# Altium schematic sheet BottomBoard.schdoc
size A1
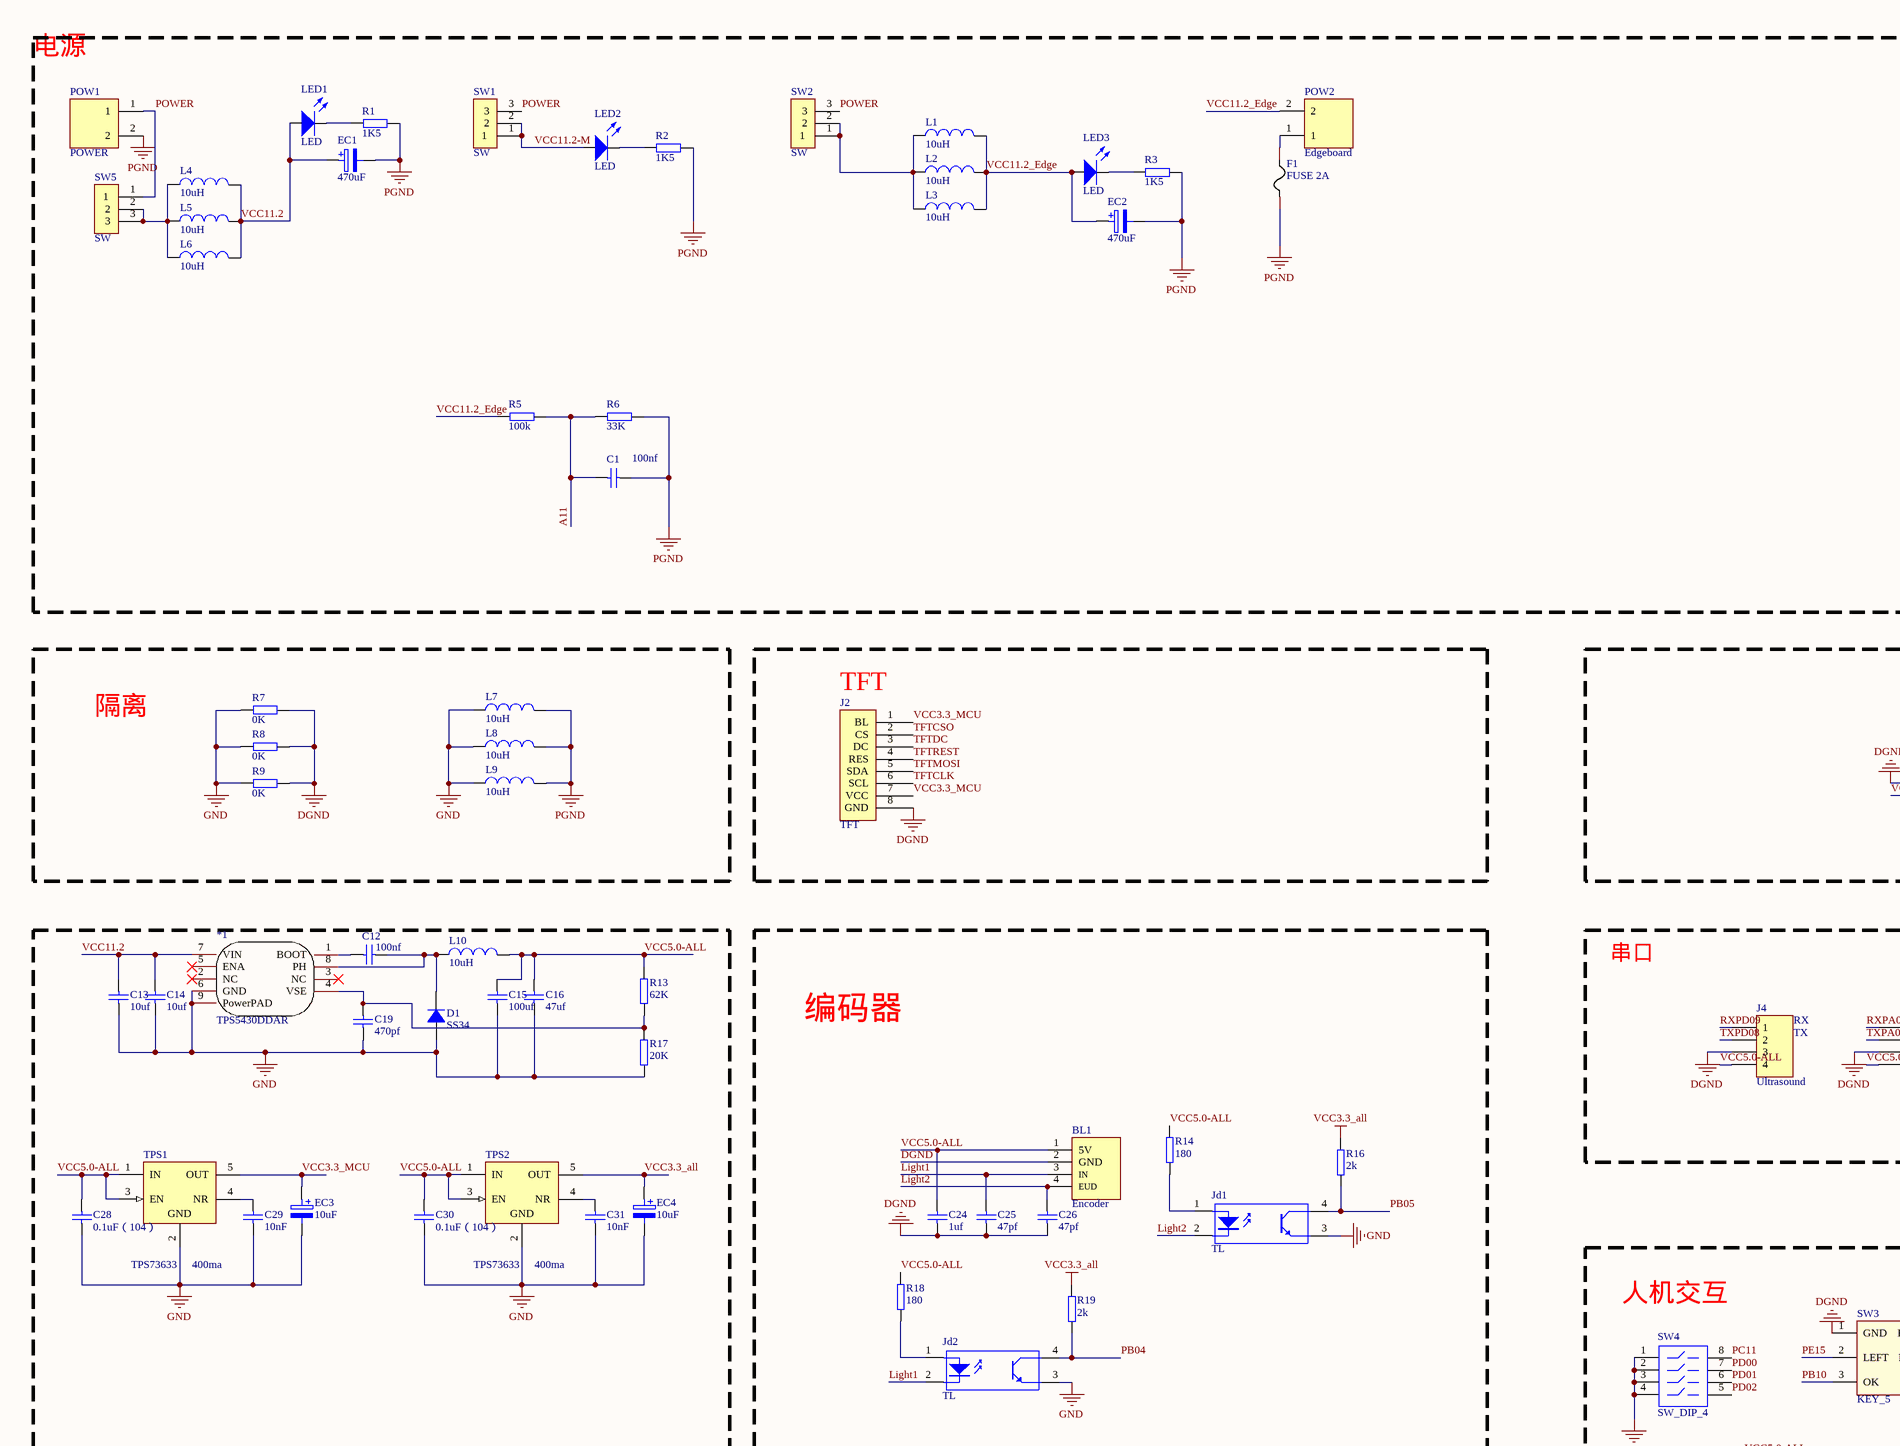
[diagram p0: BottomBoard.schdoc, top left]
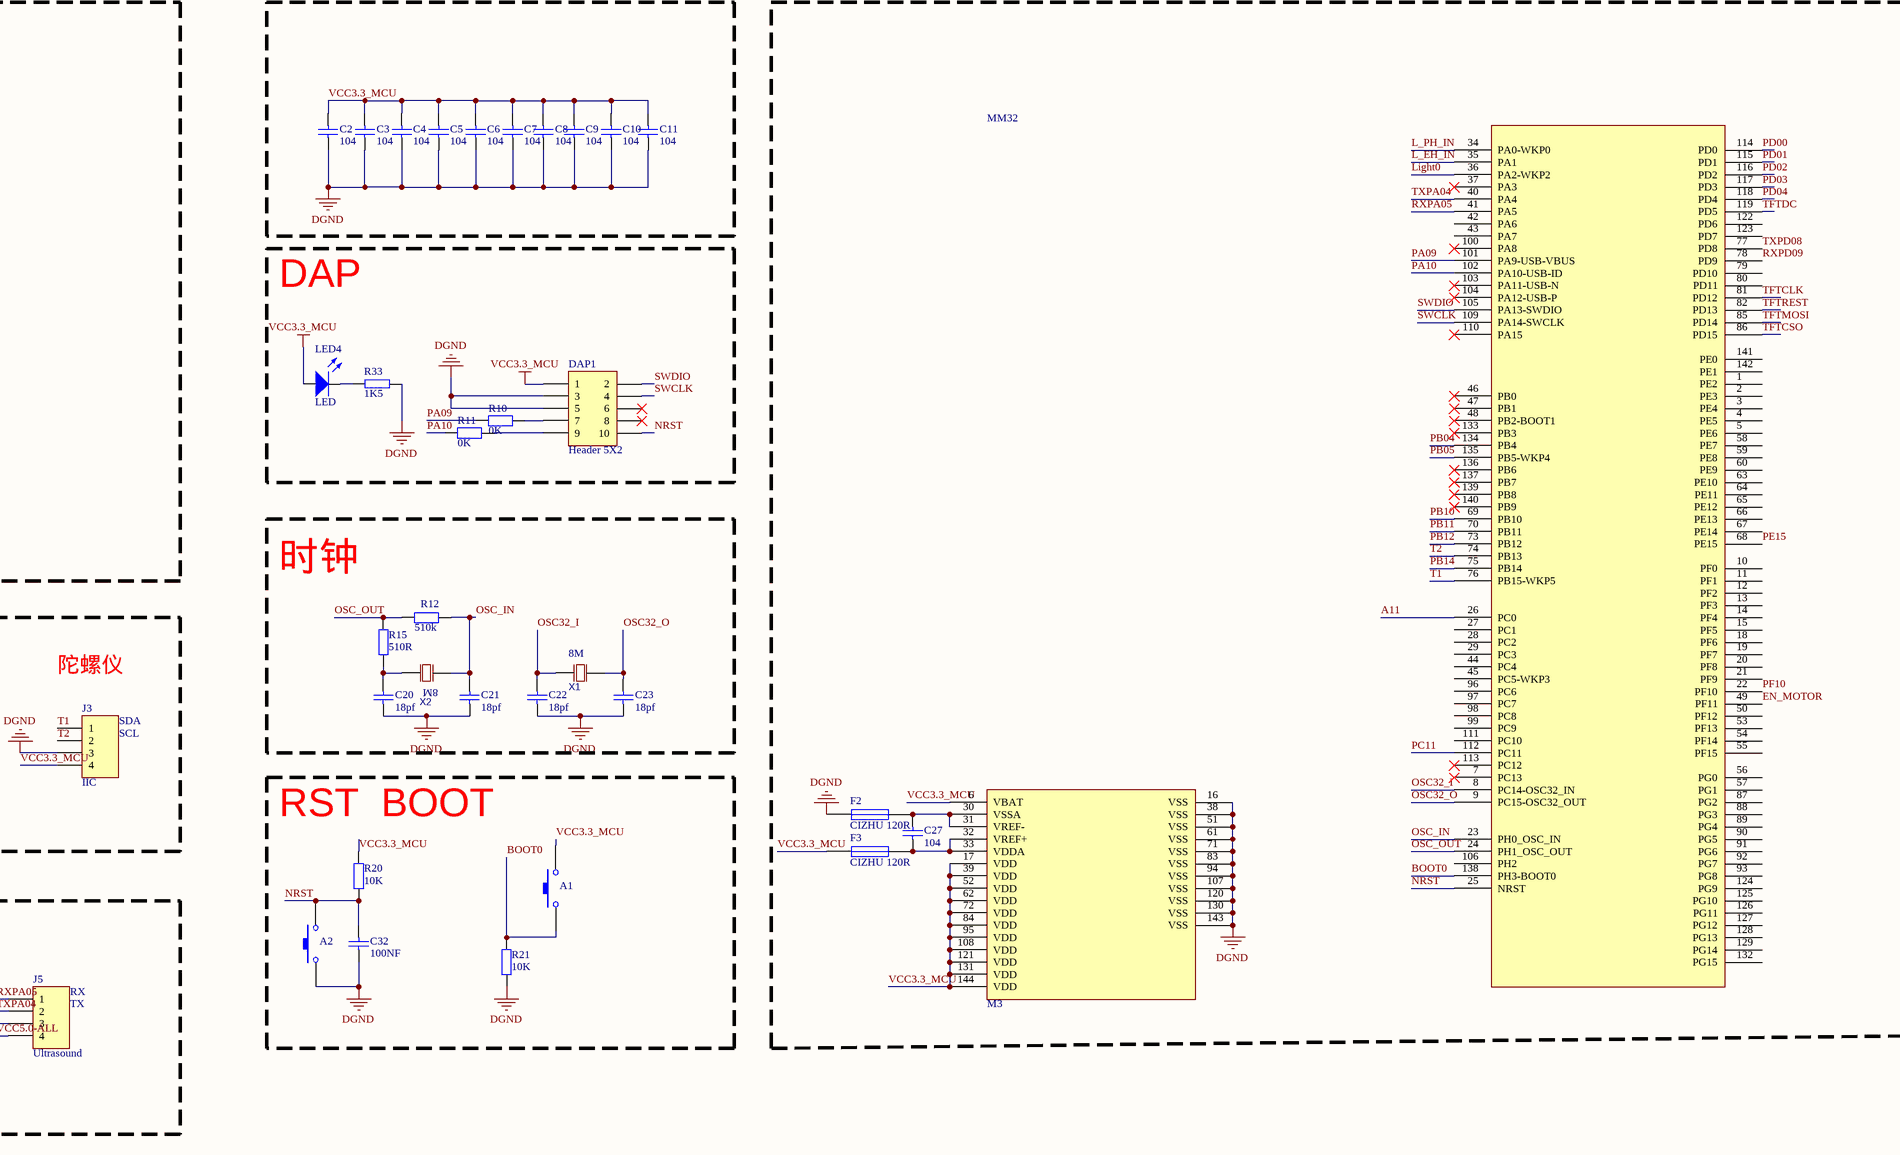
[diagram p1: BottomBoard.schdoc, top right]
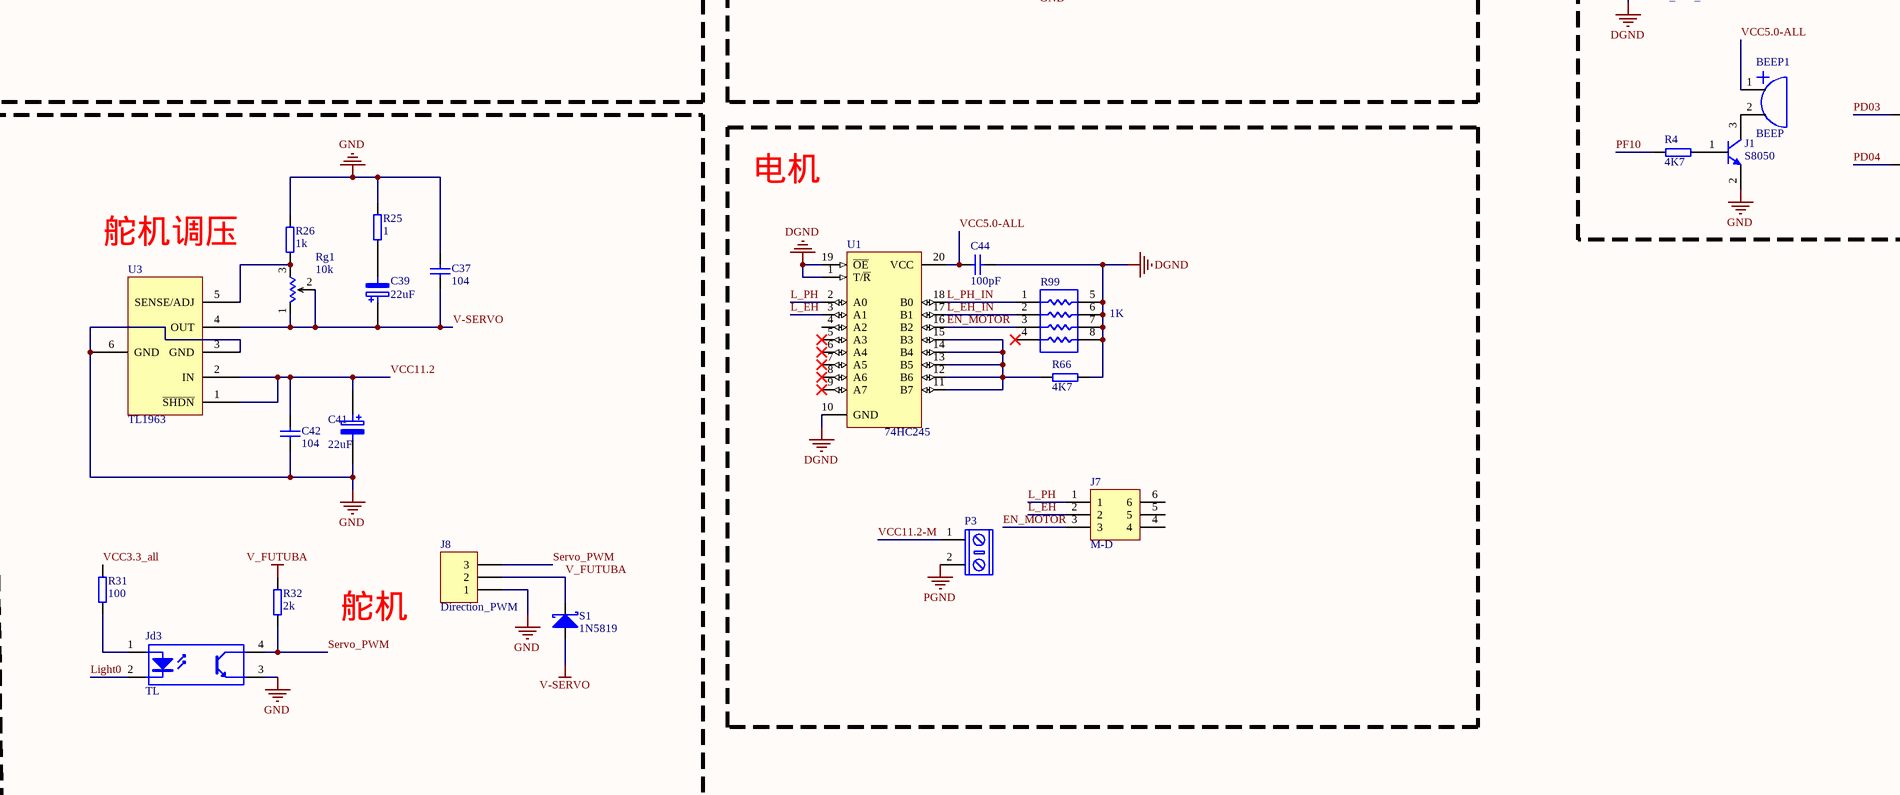
[diagram p2: BottomBoard.schdoc, bottom left]
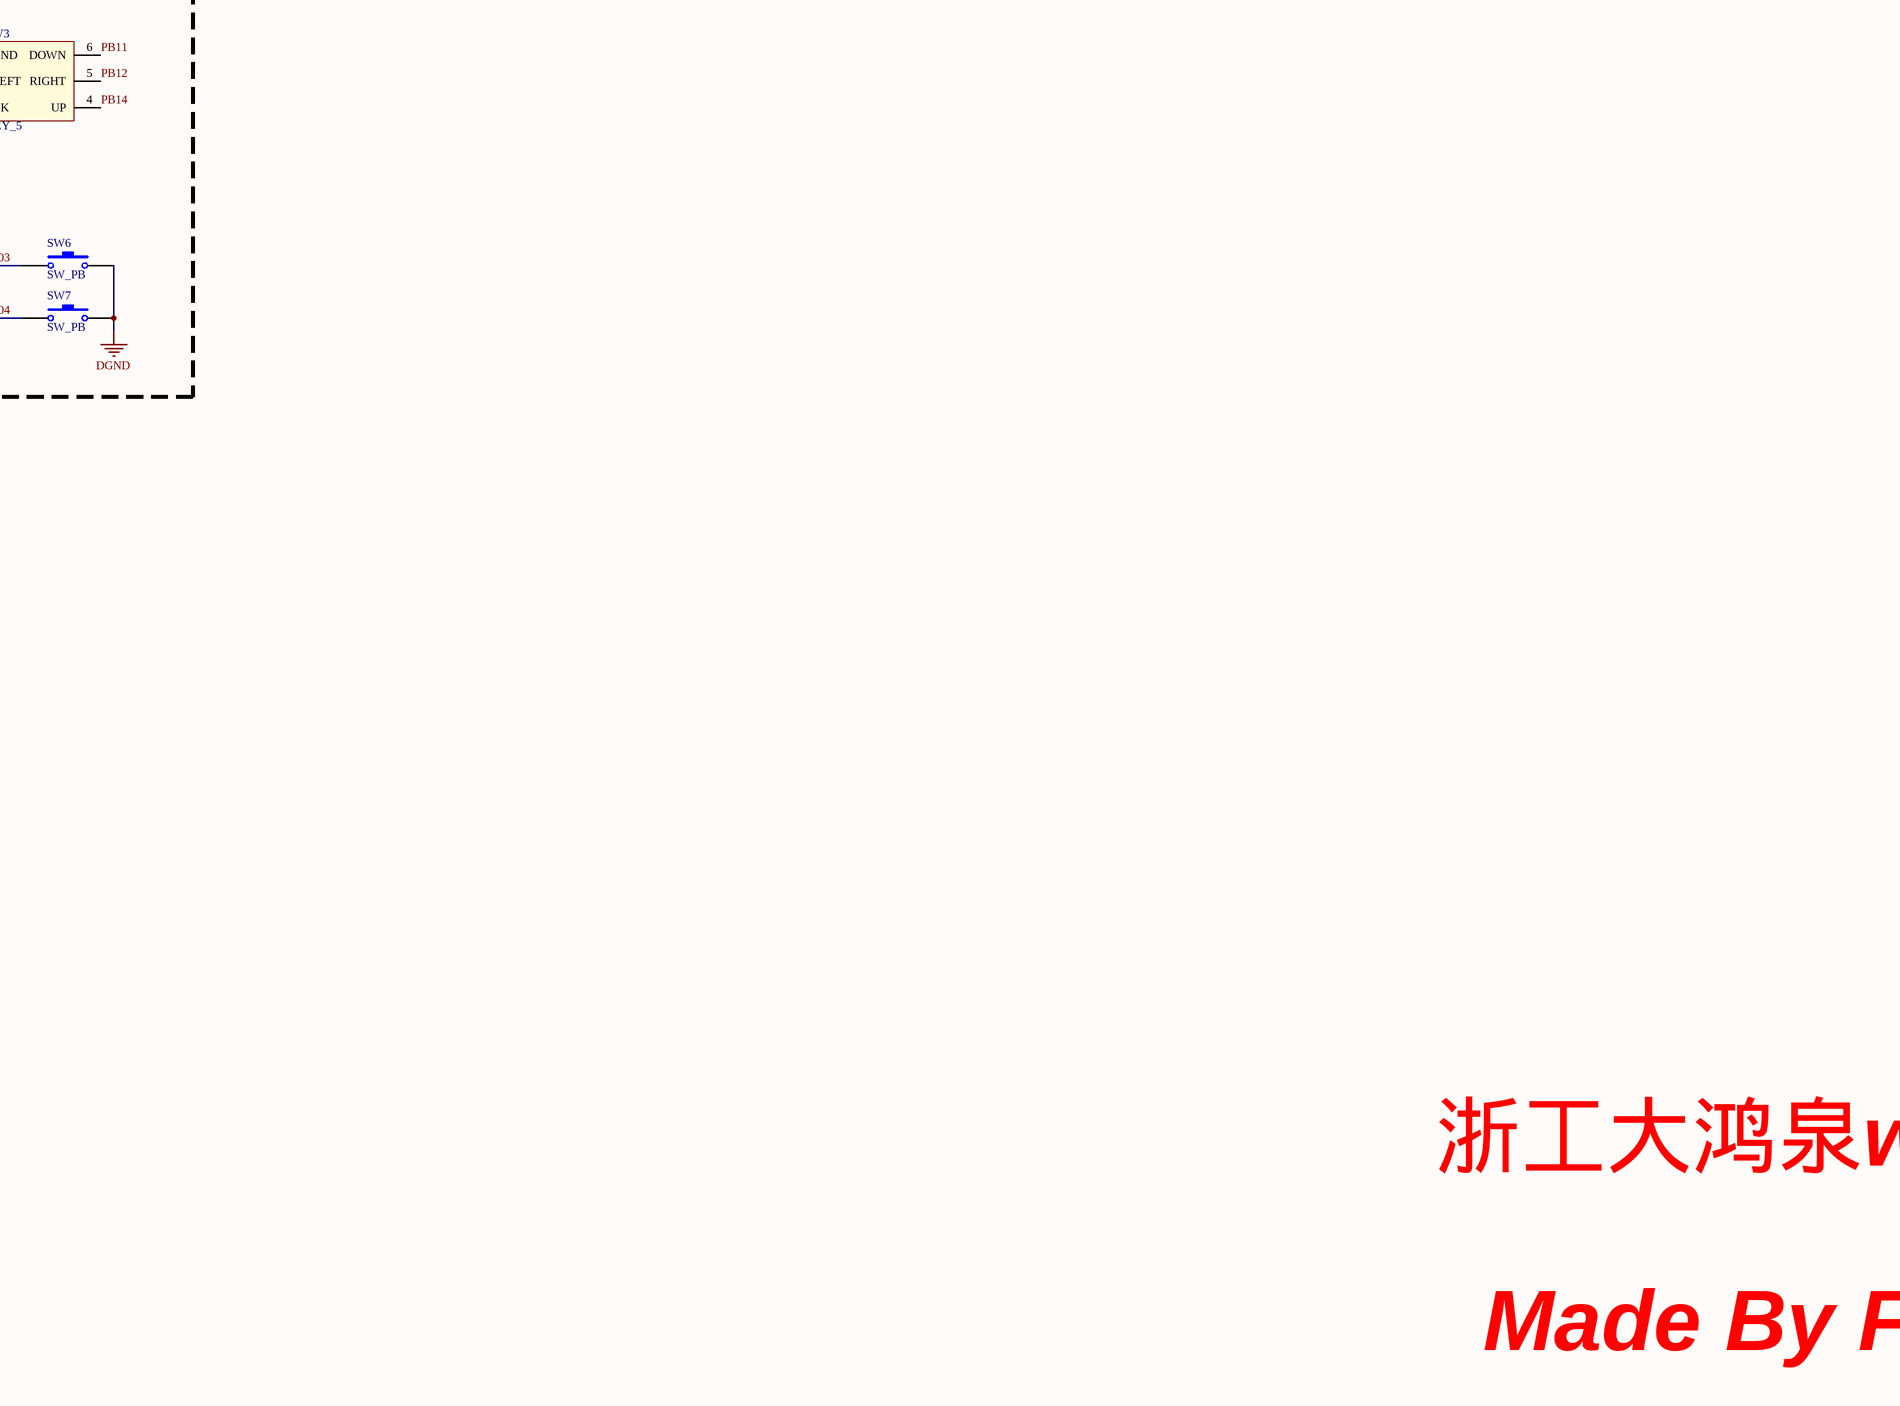
[diagram p3: BottomBoard.schdoc, bottom right]

## Parts
*1  TPS5430DDAR  [SOIC-8_L5.0-W4.0-P1.27-LS6.0-BL-EP2.0]
A1  SW-PB  [KEY-SMD_B3U-1000PM]  (value not drawn)
A2  SW-PB  [KEY-SMD_B3U-1000PM]  (value not drawn)
BEEP1  BEEP  [BEEP]
BL1  Encoder  [HDR1X4_2.54_4pin]
C1  100nf  [0603_C]
C2  104  [0603_C]
C3  104  [0603_C]
C4  104  [0603_C]
C5  104  [0603_C]
C6  104  [0603_C]
C7  104  [0603_C]
C8  104  [0603_C]
C9  104  [0603_C]
C10  104  [0603_C]
C11  104  [0603_C]
C12  100nf  [0603_C]
C13  10uf  [0603_C]
C14  10uf  [0603_C]
C15  100uf  [0603_C]
C16  47uf  [0603_C]
C19  470pf  [0603_C]
C20  18pf  [LC-0603_C]
C21  18pf  [LC-0603_C]
C22  18pf  [LC-0603_C]
C23  18pf  [LC-0603_C]
C24  1uf  [0603_C]
C25  47pf  [0603_C]
C26  47pf  [0603_C]
C27  104  [0603_C]
C28  0.1uF（104）  [0603_C]
C29  10nF  [0603_C]
C30  0.1uF（104）  [0603_C]
C31  10nF  [0603_C]
C32  100NF  [LC-0603_C]
C37  104  [0603_C]
C39  22uF  [CASE-B_3528]
C41  22uF  [CASE-B_3528]
C42  104  [0603_C]
C44  value 100pF  [0603_C]  (hidden comment: Cap)
D1  SS34  [LC-SMA(DO-214AC)_S1]
DAP1  Header 5X2  [HDR2X5]
EC1  470uF  [C-RB-5.0/10]
EC2  470uF  [C-RB-5.0/10]
EC3  10uF  [CAP-3216]
EC4  10uF  [CAP-3216]
F1  FUSE 2A  [F1206]
F2  CIZHU 120R  [FUSE]
F3  CIZHU 120R  [FUSE]
J1  S8050  [SOT23-3]
J2  TFT  [TFT]
J3  IIC  [HDR1X4_2.54_4pin]
J4  Ultrasound  [HDR1X4_2.54_4pin]
J5  Ultrasound  [HDR1X4_2.54_4pin]
J7  M-D  [MHDR2X4_1.27_8pin]
J8  Direction_PWM  [HDR1X3_2.54]
Jd1  TL  [LC-SOP-4_P2.54]
Jd2  TL  [LC-SOP-4_P2.54]
Jd3  TL  [LC-SOP-4_P2.54]
L1  10uH  [0805_L]
L2  10uH  [0805_L]
L3  10uH  [0805_L]
L4  10uH  [0805_L]
L5  10uH  [0805_L]
L6  10uH  [0805_L]
L7  10uH  [0805_L]
L8  10uH  [0805_L]
L9  10uH  [0805_L]
L10  10uH  [IND-SMD_L7.1-W6.6]
LED1  LED  [0805_LED]
LED2  LED  [0805_LED]
LED3  LED  [0805_LED]
LED4  LED  [0805_LED]
MM32  M3  [MK60FX512VLQ15]
P3  KF/WJ/DG 30x connecter  [CON2_2]  (value not drawn)
POW1  POWER  [CON2 - duplicate]
POW2  Edgeboard  [CON2 - duplicate]
R1  1K5  [0603_R]
R2  1K5  [0603_R]
R3  1K5  [0603_R]
R4  4K7  [0603_R]
R5  100k  [0603_R]
R6  33K  [0603_R]
R7  0K  [0603_R]
R8  0K  [0603_R]
R9  0K  [0603_R]
R10  0k  [0603_R]
R11  0k  [0603_R]
R12  value 510k  [0603_R]  (hidden comment: 0k)
R13  62K  [0603_R]
R14  180  [0603_R]
R15  value 510R  [0603_R]  (hidden comment: 0k)
R16  2k  [0603_R]
R17  20K  [0603_R]
R18  180  [0603_R]
R19  2k  [0603_R]
R20  value 10K  [LC-0805_R]  (hidden comment: 0k)
R21  value 10K  [0603_R]  (hidden comment: 0k)
R25  1  [0603_R]
R26  1k  [0603_R]
R31  100  [0603_R]
R32  2k  [0603_R]
R33  1K5  [0603_R]
R66  4K7  [0603_R]
R99  value 1K  [LC-0603_Rx4]  (hidden comment: Res Pack)
Rg1  10k  [VR-3296W - duplicate]
S1  1N5819  [SMA_L4.3-W2.6-LS5.2-RD]
SW1  SW  [钮子开关-小]
SW2  SW  [钮子开关-小]
SW3  KEY_5  [KEY_5]
SW4  SW_DIP_4  [SW-SMD_8P-L6.3-W4.5-P1.27-LS8.1]
SW5  SW  [钮子开关-小]
SW6  SW_PB  [SW_PB]
SW7  SW_PB  [SW_PB]
TPS1  TPS73633  [SOT-23-5]
TPS2  TPS73633  [SOT-23-5]
U1  74HC245  [TSSOP20]
U3  TL1963  [TL1963]
X1  32.765  [XTAL8M]  (value not drawn)
X2  8MHz  [XTAL8M]  (value not drawn)

## Blocks framed on the sheet
电源: C1 EC1 EC2 F1 L1-L6 LED1-LED3 POW1 POW2 R1-R3 R5 R6 SW1 SW2 SW5
DAP: DAP1 LED4 R10 R11 R33
时钟: C20-C23 R12 R15 X1 X2
隔离: L7-L9 R7-R9
TFT: J2
陀螺仪: J3
RST  BOOT: A1 A2 C32 R20 R21
编码器: BL1 C24-C26 Jd1 Jd2 R14 R16 R18 R19
串口: J4 J5
人机交互: BEEP1 J1 R4 SW3 SW4 SW6 SW7
电机: C44 J7 P3 R66 R99 U1

## Nets
DGND: A2.1 BL1.2(GND) C2.2 C3.2 C4.2 C5.2 C6.2 C7.2 C8.2 C9.2 C10.2 C11.2 C20.2 C21.2 C22.2 C23.2 C24.1 C25.1 C26.2 C32.1 C44.1 DAP1.3 DAP1.5 F2.1 J2.8(GND) J3.3 J4.3 J5.3 MM32.16(VSS) MM32.38(VSS) MM32.51(VSS) MM32.61(VSS) MM32.71(VSS) MM32.83(VSS) MM32.94(VSS) MM32.107(VSS) MM32.120(VSS) MM32.130(VSS) MM32.143(VSS) R7.2 R8.2 R9.2 R21.1 R33.2 R66.2 R99.5 R99.6 R99.7 R99.8 SW3.1(GND) SW4.1 SW4.2 SW4.3 SW4.4 SW6.2 SW7.2 U1.1(T/~{R}) U1.10(GND) U1.19(~{OE})
GND: *1.6(GND) *1.9(PowerPAD) C13.2 C14.2 C15.2 C16.2 C19.2 C28.2 C29.2 C30.2 C31.2 C37.2 C41.2 C42.1 D1.1 EC3.2 EC4.2 J1.2(E) J8.1 Jd1.3(E) Jd2.3(E) Jd3.3(E) L7.1 L8.1 L9.1 R7.1 R8.1 R9.1 R17.1 R25.2 R26.2 TPS1.2(GND) TPS2.2(GND) U3.3(GND) U3.6(GND)
PGND: C1.2 EC1.2 EC2.2 F1.1 L7.2 L8.2 L9.2 P3.2 POW1.2 R1.2 R2.2 R3.2 R6.2
V-SERVO: C37.1 C39.1 Rg1.1 Rg1.2 S1.1(A) U3.4(OUT)
V_FUTUBA: J8.2 R32.2 S1.2(K)
VCC3.3_all: EC4.1 R16.2 R19.2 R31.2 TPS2.5(OUT)
VCC3.3_MCU: A1.2 C2.1 C3.1 C4.1 C5.1 C6.1 C7.1 C8.1 C9.1 C10.1 C11.1 DAP1.1 EC3.1 F3.1 J2.1(BL) J2.7(VCC) J3.4 LED4.1(A) MM32.6(VBAT) MM32.17(VDD) MM32.39(VDD) MM32.52(VDD) MM32.62(VDD) MM32.72(VDD) MM32.84(VDD) MM32.95(VDD) MM32.108(VDD) MM32.121(VDD) MM32.131(VDD) MM32.144(VDD) R20.2 TPS1.5(OUT)
A11: C1.1 MM32.26(PC0) R5.2 R6.1
BOOT0: A1.1 MM32.138(PH3-BOOT0) R21.2
EN_MOTOR: J7.3 MM32.49(PF11) R99.3 U1.16(B2)
L_EH: J7.2 U1.3(A1)
L_EH_IN: MM32.35(PA1) R99.2 U1.17(B1)
L_PH: J7.1 U1.2(A0)
L_PH_IN: MM32.34(PA0-WKP0) R99.1 U1.18(B0)
Light0: Jd3.2(K) MM32.36(PA2-WKP2)
Light1: BL1.3(IN) C25.2 Jd2.2(K)
Light2: BL1.4(EUD) C26.1 Jd1.2(K)
NRST: A2.2 C32.2 DAP1.10 MM32.25(NRST) R20.1
OSC32_I: C22.1 MM32.8(PC14-OSC32_IN) X1.1(OSC1)
OSC32_O: C23.1 MM32.9(PC15-OSC32_OUT) X1.2(OSC2)
OSC_IN: C21.1 MM32.23(PH0_OSC_IN) R12.1 X2.1(OSC1)
OSC_OUT: MM32.24(PH1_OSC_OUT) R12.2 R15.2
PA09: MM32.101(PA9-USB-VBUS) R10.1
PA10: MM32.102(PA10-USB-ID) R11.1
PB04: Jd2.4(C) MM32.134(PB4) R19.1
PB05: Jd1.4(C) MM32.135(PB5-WKP4) R16.1
PB10: MM32.69(PB10) SW3.3(OK)
PB11: MM32.70(PB11) SW3.6(DOWN)
PB12: MM32.73(PB12) SW3.5(RIGHT)
PB14: MM32.75(PB14) SW3.4(UP)
PC11: MM32.112(PC11) SW4.8
PD00: MM32.114(PD0) SW4.7
PD01: MM32.115(PD1) SW4.6
PD02: MM32.116(PD2) SW4.5
PD03: MM32.117(PD3) SW6.1
PD04: MM32.118(PD4) SW7.1
PE15: MM32.68(PE15) SW3.2(LEFT)
PF10: MM32.22(PF10) R4.2
POWER: POW1.1 SW1.3 SW2.3 SW5.1
RXPA05: J5.1 MM32.41(PA5)
RXPD09: J4.1 MM32.78(PD9)
Servo_PWM: J8.3 Jd3.4(C) R32.1
SWCLK: DAP1.4 MM32.109(PA14-SWCLK)
SWDIO: DAP1.2 MM32.105(PA13-SWDIO)
T1: J3.1 MM32.76(PB15-WKP5)
T2: J3.2 MM32.74(PB13)
TFTCLK: J2.6(SCL) MM32.81(PD12)
TFTCSO: J2.2(CS) MM32.86(PD15)
TFTDC: J2.3(DC) MM32.119(PD5)
TFTMOSI: J2.5(SDA) MM32.85(PD14)
TFTREST: J2.4(RES) MM32.82(PD13)
TXPA04: J5.2 MM32.40(PA4)
TXPD08: J4.2 MM32.77(PD8)
VCC5.0-ALL: BEEP1.1 BL1.1(5V) C15.1 C16.1 C24.2 C28.1 C30.1 C44.2 J4.4 J5.4 L10.2 R13.2 R14.2 R18.2 TPS1.1(IN) TPS1.3(EN) TPS2.1(IN) TPS2.3(EN) U1.20(VCC)
VCC11.2: *1.7(VIN) C13.1 C14.1 C41.1 C42.2 EC1.1 L4.2 L5.2 L6.2 LED1.1(A) U3.1(~{SHDN}) U3.2(IN)
VCC11.2-M: LED2.1(A) P3.1 SW1.1 SW1.2
VCC11.2_Edge: EC2.1 L1.2 L2.2 L3.2 LED3.1(A) POW2.2 R5.1
Net*1_1: *1.1(BOOT) C12.1
Net*1_4: *1.4(VSE) C19.1 R13.1 R17.2
Net*1_8: *1.8(PH) C12.2 D1.2 L10.1
NetBEEP1_2: BEEP1.2 J1.3(C)
NetC20_1: C20.1 R15.1 X2.2(OSC2)
NetC27_1: C27.1 F2.2 MM32.30(VSSA) MM32.31(VREF-)
NetC27_2: C27.2 F3.2 MM32.32(VREF+) MM32.33(VDDA)
NetC29_1: C29.1 TPS1.4(NR)
NetC31_1: C31.1 TPS2.4(NR)
NetC39_2: C39.2 R25.1
NetDAP1_7: DAP1.7 R10.2
NetDAP1_9: DAP1.9 R11.2
NetF1_2: F1.2 POW2.1
NetJ1_1: J1.1(B) R4.1
NetJd1_1: Jd1.1(A) R14.1
NetJd2_1: Jd2.1(A) R18.1
NetJd3_1: Jd3.1(A) R31.1
NetL1_1: L1.1 L2.1 L3.1 SW2.1 SW2.2
NetL4_1: L4.1 L5.1 L6.1 SW5.2 SW5.3
NetLED1_2: LED1.2(K) R1.1
NetLED2_2: LED2.2(K) R2.1
NetLED3_2: LED3.2(K) R3.1
NetLED4_2: LED4.2(K) R33.1
NetR26_1: R26.1 Rg1.3 U3.5(SENSE/ADJ)
NetR66_1: R66.1 U1.11(B7) U1.12(B6) U1.13(B5) U1.14(B4) U1.15(B3)

Not connected (* = marked no-connect by the designer): *1 2(NC)* 3(NC)* 5(ENA)*; DAP1 6* 8*; J7 4 5 6; MM32 1(PE2) 2(PE3) 3(PE4) 4(PE5) 5(PE6) 7(PC13)* 10(PF0) 11(PF1) 12(PF2) 13(PF3) 14(PF4) 15(PF5) 18(PF6) 19(PF7) 20(PF8) 21(PF9) 27(PC1) 28(PC2) 29(PC3) 37(PA3)* 42(PA6) 43(PA7) 44(PC4) 45(PC5-WKP3) 46(PB0)* 47(PB1)* 48(PB2-BOOT1)* 50(PF12) 53(PF13) 54(PF14) 55(PF15) 56(PG0) 57(PG1) 58(PE7) 59(PE8) 60(PE9) 63(PE10) 64(PE11) 65(PE12) 66(PE13) 67(PE14) 79(PD10) 80(PD11) 87(PG2) 88(PG3) 89(PG4) 90(PG5) 91(PG6) 92(PG7) 93(PG8) 96(PC6) 97(PC7) 98(PC8) 99(PC9) 100(PA8)* 103(PA11-USB-N)* 104(PA12-USB-P)* 106(PH2) 110(PA15)* 111(PC10) 113(PC12)* 122(PD6) 123(PD7) 124(PG9) 125(PG10) 126(PG11) 127(PG12) 128(PG13) 129(PG14) 132(PG15) 133(PB3)* 136(PB6)* 137(PB7)* 139(PB8)* 140(PB9)* 141(PE0) 142(PE1); R99 4*; U1 4(A2) 5(A3)* 6(A4)* 7(A5)* 8(A6)* 9(A7)*

## Notes on the sheet
- (near J3) SDA
- (near J3) SCL
- (near J4) RX
- (near J5) RX
- (near J4) TX
- (near J5) TX
- 400ma
- 舵机调压
- 舵机
- 浙工大鸿泉woe
- Made By Fly
- (in symbol 8MHz) 8M

## Library data of the parts
A1 A2 = SW-PB: 两脚贴片微动开关; Published: 24-Mar-1999; LatestRevisionDate: 17-Jul-2002; LatestRevisionNote: Re-released for DXP Platform.; PackageReference: SPST-2; Publisher: Altium Limited
BEEP1 = BEEP: 有源5v蜂鸣器
BL1 = Encoder: 编码器
C1 C12 = CAP: 0805
C2-C11 C27 = CAP-0603
C13-C16 C19 C24-C26 C28-C31 = CAP: 电容
C20-C23 C32 = Cap
C37 C42 C44 = Cap: Capacitor; Published: 8-Jun-2000; LatestRevisionDate: 17-Jul-2002; LatestRevisionNote: Re-released for DXP Platform.; Publisher: Altium Limited
  C37 C42: Value: 104
  C44: PackageReference: RAD-0.3; PackageDescription: Radial Cap, Thru-Hole; 2 Leads; 0.3 in Pin Spacing
C39 C41 = ELECTRO2_1: Electrolytic Capacitor
D1 = 1N5819: 1N5819 二极管 Diode; Imax: 500mA; Published: 8-Jun-2000; Revision: July-2002: Re-released for DXP Platform.; Publisher: Altium Limited; Price(RMB): 0.000
DAP1 = Header 5X2: Header, 5-Pin, Dual row; LatestRevisionDate: 17-Jul-2002; LatestRevisionNote: Re-released for DXP Platform.; Publisher: Altium Limited
EC1 EC2 = CAP_E: 电解电容
EC3 EC4 = CAP_E: 极性电容
F1 = FUSE 2a 12v
F2 F3 = Fuse 1: Fuse; Published: 8-Jun-2000; LatestRevisionDate: 17-Jul-2002; LatestRevisionNote: Re-released for DXP Platform.; PackageReference: PIN-W2/E2.8; Publisher: Altium Limited
J1 = S8050: 贴片三极管
J2 = TFT: 1.8寸显示屏
J3 = URAT: 串口排针
J4 J5 = URAT: 超声波
J7 = M-D: 主板与驱动板接口
Jd1-Jd3 = TLP281: 光耦; Published: 24-Mar-1999; LatestRevisionDate: 04-Mar-2005; LatestRevisionNote: Sch pins 3 & 4 Swapped.; DatasheetDocument: Nov-2003; PackageReference: DIP-4; Publisher: Altium Limited
L1-L10 = IND: 电感
LED1-LED4 = LED: 发光二极管
P3 = KF/WJ/DG 30x: 接线端子 2Pin
POW1 POW2 = POWER: 电源
R1-R9 R13 R14 R16-R19 R25 R26 R31-R33 R66 = RES: 电阻
R10-R12 R15 R20 R21 = Res: Resistor; Published: 8-Jun-2000; LatestRevisionDate: 17-Jul-2002; LatestRevisionNote: Re-released for DXP Platform.; PackageReference: AXIAL-0.4; Publisher: Altium Limited
  R10 R11: Value: 0K
R99 = Res Pack: Isolated Resistor Network; Published: 24-Mar-1999; LatestRevisionDate: 29-May-2009; LatestRevisionNote: IPC-7351 Footprint Added.; PackageReference: SO-16; Publisher: Altium Limited; PackageDescription: 16-Pin Small Outline Integrated Circuit 1.27 mm Pitch; Code_JEDEC: MS-012-AC; Code_IPC: SOIC127P600-16
Rg1 = changabelRES
S1 = 1N5819: 肖基特二极管
SW1 SW2 SW5 = SW: 钮子开关
SW3 = KEY_5: 五向导航按钮
SW4 = SW_DIP_4: 4位拨码开关
SW6 SW7 = SW_PB: 两脚贴片微动开关
TPS1 TPS2 = TPS73633: 线性稳压器
U1 = SN74LVC245DW: Octal Bus Transceiver with 3-State Outputs; ComponentAvailability: Obsolete; Published: 8-Jun-2000; LatestRevisionDate: 13-Apr-2006; LatestRevisionNote: IPC-7351 Footprint Added.; DatasheetVersion: Jul-1994; PackageVersion: Mar-2000; PackageReference: DW020; Publisher: Altium Limited; PackageDescription: 20-Pin Plastic Small Outline Integrated Circuit 1.27 mm Pitch; Code_JEDEC: MS-013; Code_IPC: SOIC127P1030-20; ComponentLink1Description: Manufacturer Link; ComponentLink1URL: http://www.ti.com/; ComponentLink2Description: URL Link1; ComponentLink2URL: http://focus.ti.com/docs/prod/folders/print/sn74lvc245.html
X1 X2 = 8MHz: BOM_Manufacturer: SHENZHEN CRYSTAL TECH; BOM_Manufacturer Part: 6I08000F20UCG; nameAlias: Frequency; Contributor: LCSC; BOM_Supplier: LCSC; BOM_Supplier Part: C251585; spicePre: X; spiceSymbolName: 6I08000F20UCG